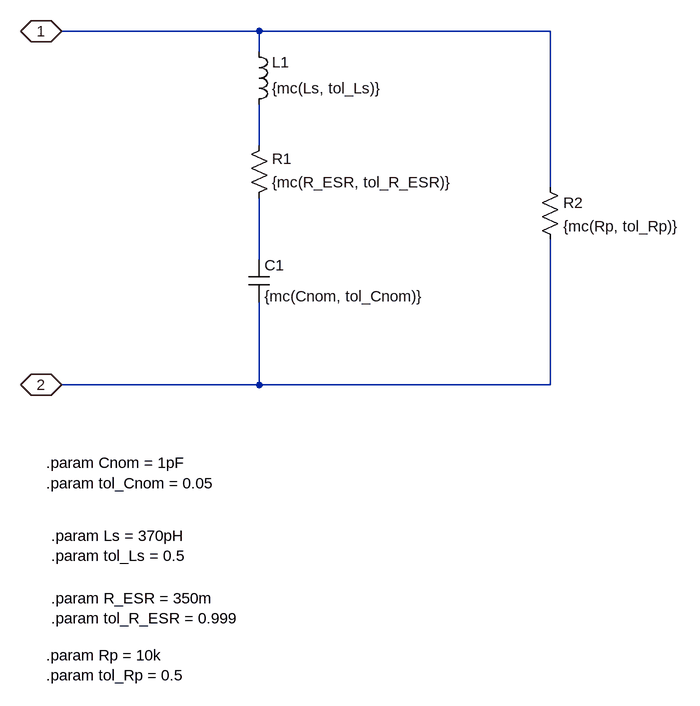
[diagram p0: schematic GJM0335C1E1R0WB01D.asc]
GJM0335C1E1R0WB01D.asc, the LTspice schematic file:
Version 4
SHEET 1 1332 1072
WIRE 336 -96 32 -96
WIRE 784 -96 336 -96
WIRE 336 -64 336 -96
WIRE 336 80 336 16
WIRE 784 144 784 -96
WIRE 336 256 336 160
WIRE 336 448 336 320
WIRE 336 448 32 448
WIRE 784 448 784 224
WIRE 784 448 336 448
FLAG 32 448 2
IOPIN 32 448 BiDir
FLAG 32 -96 1
IOPIN 32 -96 BiDir
SYMBOL ind 320 32 M180
WINDOW 0 36 80 Left 2
WINDOW 3 36 40 Left 2
SYMATTR InstName L1
SYMATTR Value {mc(Ls, tol_Ls)}
SYMBOL res 320 176 M180
WINDOW 0 36 76 Left 2
WINDOW 3 36 40 Left 2
SYMATTR InstName R1
SYMATTR Value {mc(R_ESR, tol_R_ESR)}
SYMBOL cap 320 256 R0
SYMATTR InstName C1
SYMATTR Value {mc(Cnom, tol_Cnom)}
SYMBOL res 768 128 R0
SYMATTR InstName R2
SYMATTR Value {mc(Rp, tol_Rp)}
TEXT 16 680 Left 2 !.param Ls = 370pH\n.param tol_Ls = 0.5
TEXT 16 776 Left 2 !.param R_ESR = 350m\n.param tol_R_ESR = 0.999
TEXT 8 568 Left 2 !.param Cnom = 1pF\n.param tol_Cnom = 0.05
TEXT 8 864 Left 2 !.param Rp = 10k\n.param tol_Rp = 0.5

The netlist it stands for:
* GJM0335C1E1R0WB01D.asc
L1 N001 1 {mc(Ls, tol_Ls)}
R1 N002 N001 {mc(R_ESR, tol_R_ESR)}
C1 N002 2 {mc(Cnom, tol_Cnom)}
R2 1 2 {mc(Rp, tol_Rp)}
.param Ls = 370pH
.param tol_Ls = 0.5
.param R_ESR = 350m
.param tol_R_ESR = 0.999
.param Cnom = 1pF
.param tol_Cnom = 0.05
.param Rp = 10k
.param tol_Rp = 0.5
.backanno
.end